# EAGLE schematic Powersupply_RevA_discrete (EAGLE 9.4.2)

## Sheet 1 of 2
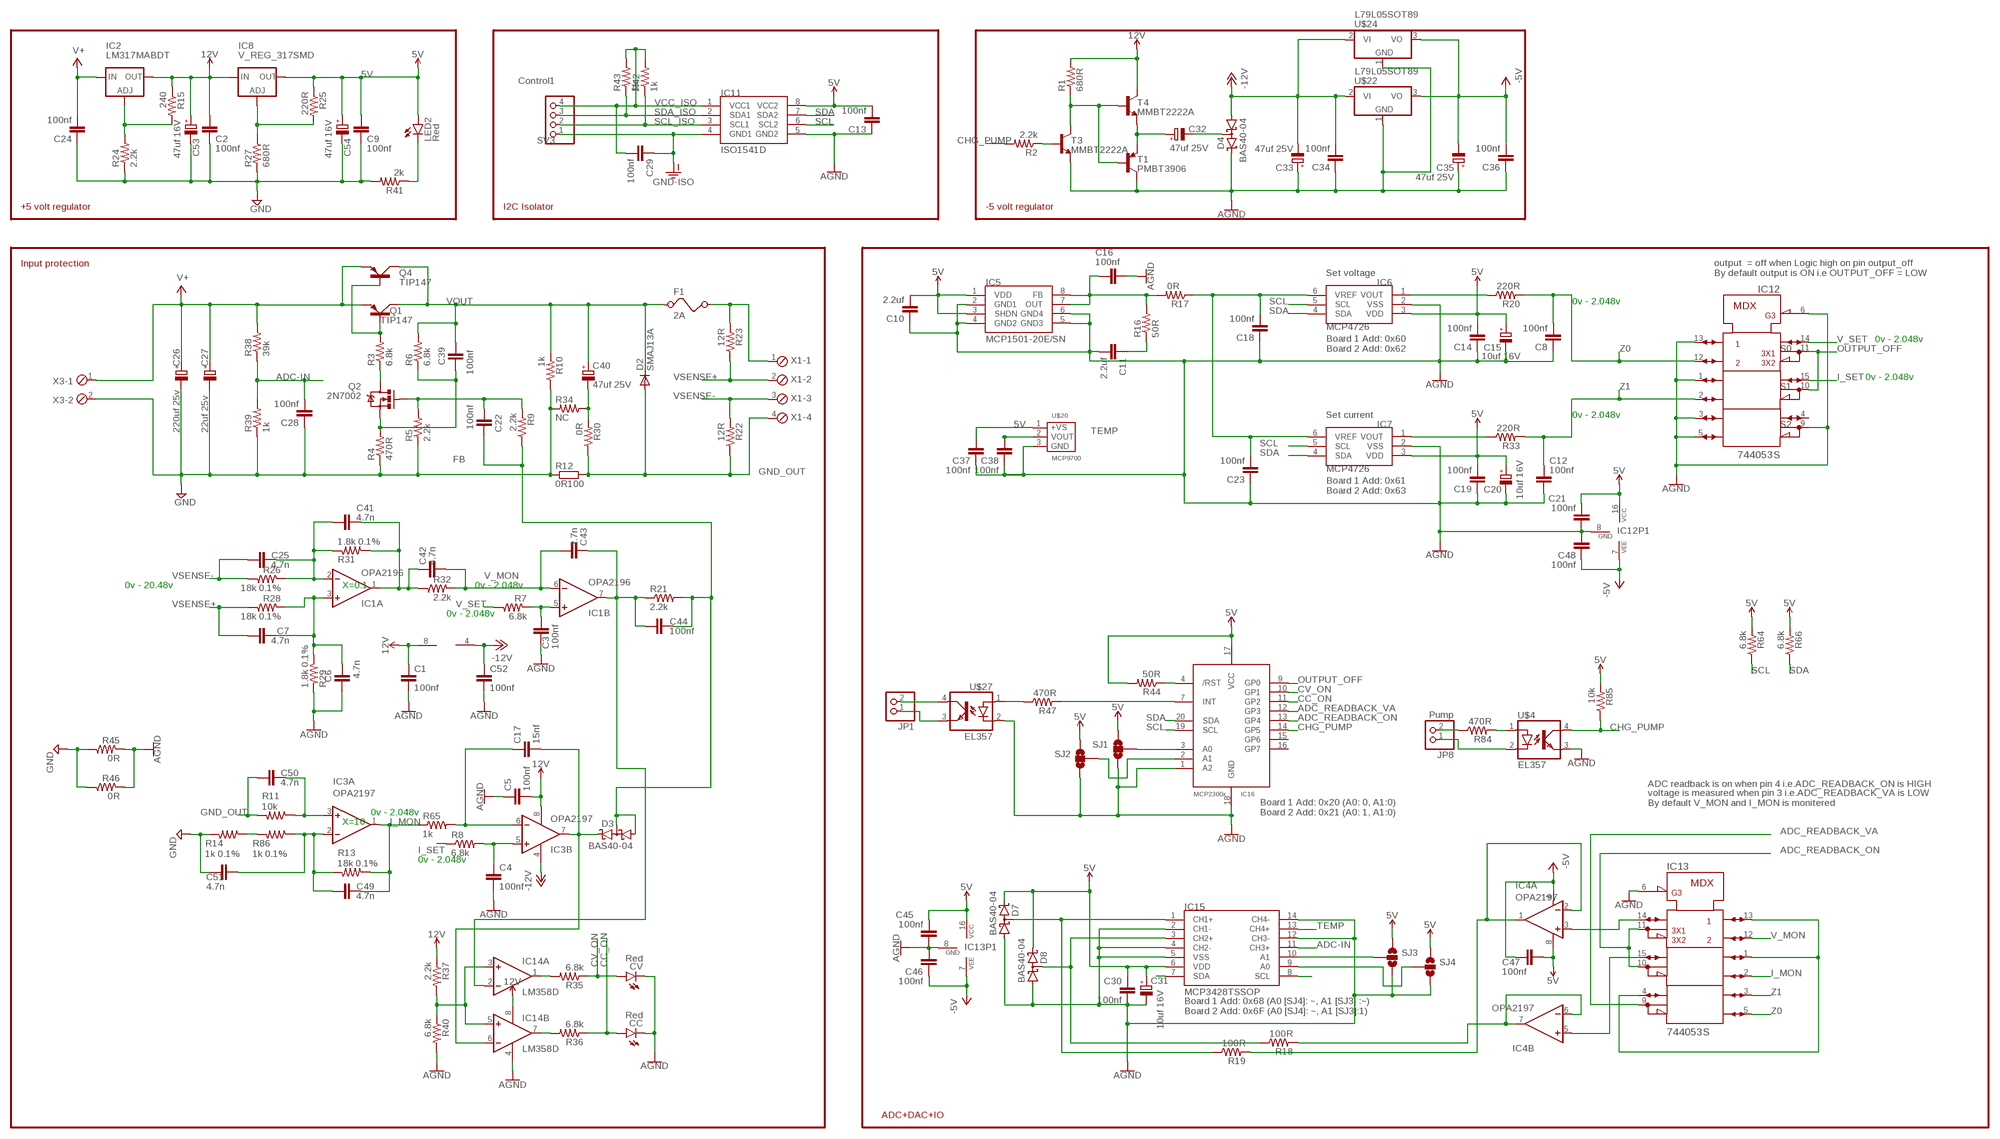
[diagram p0: schematic, sheet 1]

### Parts
C1  100nf  C-EUC0603  [C0603]
C2  100nf  C-EUC0603  [C0603]
C3  100nf  C-EUC0603  [C0603]
C4  100nf  C-EUC0805  [C0805]
C5  100nf  C-EUC0603  [C0603]
C6  4.7n  C-EUC0805  [C0805]
C7  4.7n  C-EUC0805  [C0805]
C8  100nf  C-EUC0603  [C0603]
C9  100nf  C-EUC0603  [C0603]
C10  2.2uf  C-EUC0805  [C0805]
C11  2.2uf  C-EUC0805  [C0805]
C12  100nf  C-EUC0603  [C0603]
C13  100nf  C-EUC0603  [C0603]
C14  100nf  C-EUC0603  [C0603]
C15  10uf 16V  CPOL-EUE2-5  [E2-5]
C16  100nf  C-EUC0603  [C0603]
C17  15nf  C-EUC0805  [C0805]
C18  100nf  C-EUC0603  [C0603]
C19  100nf  C-EUC0603  [C0603]
C20  10uf 16V  CPOL-EUE2-5  [E2-5]
C21  100nf  C-EUC0603  [C0603]
C22  100nf  C-EUC0805  [C0805]
C23  100nf  C-EUC0603  [C0603]
C24  100nf  C-EUC0603  [C0603]
C25  4.7n  C-EUC0805  [C0805]
C26  220uf 25v  CPOL-EUE3.5-8  [E3,5-8]
C27  22uf 25v  CPOL-EUE3.5-8  [E3,5-8]
C28  100nf  C-EUC0603  [C0603]
C29  100nf  C-EUC0603  [C0603]
C30  100nf  C-EUC0603  [C0603]
C31  10uf 16V  CPOL-EUE2-5  [E2-5]
C32  47uf 25V  CPOL-EUCT6032  [CT6032]
C33  47uf 25V  CPOL-EUE2-5  [E2-5]
C34  100nf  C-EUC0603  [C0603]
C35  47uf 25V  CPOL-EUE2-5  [E2-5]
C36  100nf  C-EUC0603  [C0603]
C37  100nf  C-EUC0603  [C0603]
C38  100nf  C-EUC0603  [C0603]
C39  100nf  C-EUC0603  [C0603]
C40  47uf 25V  CPOL-EUE2-5  [E2-5]
C41  4.7n  C-EUC0805  [C0805]
C42  4.7n  C-EUC0805  [C0805]
C43  2.7n  C-EUC0805  [C0805]
C44  100nf  C-EUC0603  [C0603]
C45  100nf  C-EUC0603  [C0603]
C46  100nf  C-EUC0603  [C0603]
C47  100nf  C-EUC0603  [C0603]
C48  100nf  C-EUC0603  [C0603]
C49  4.7n  C-EUC0805  [C0805]
C50  4.7n  C-EUC0805  [C0805]
C51  4.7n  C-EUC0805  [C0805]
C52  100nf  C-EUC0603  [C0603]
C53  47uf 16V  CPOL-EUE2-5  [E2-5]
C54  47uf 16V  CPOL-EUE2-5  [E2-5]
CC  Red  LEDCHIP-LED0805  [CHIP-LED0805]
CV  Red  LEDCHIP-LED0805  [CHIP-LED0805]
D2  SMAJ13A  SMAJ13ASMA403A  [DO214AC]
D3  BAS40-04  [SOT23]
D4  BAS40-04  [SOT23]
D7  BAS40-04  [SOT23]
D8  BAS40-04  [SOT23]
F1  2A  FUSE  [FUSE]
IC1  OPA2196  LM358D  [SO08]
IC2  LM317MABDT  [DPACK]
IC3  OPA2197  LM358D  [SO08]
IC4  OPA2197  OPA2237U  [SO08]
IC5  MCP1501-20E/SN  [SO-08]
IC6  MCP4726  [SOT23-6]
IC7  MCP4726  [SOT23-6]
IC8  V_REG_317SMD  [SOT223]
IC11  ISO1541D  [SO-08]
IC12  744053S  [SO16]
IC13  744053S  [SO16]
IC14  LM358D  [SO08]
IC15  MCP3428TSSOP  [TSSOP14]
IC16  MCP23008QFN20  [QFN20]
JP1  PINHD-1X2  [1X02]
JP8  Pump  PINHD-1X2  [1X02]
LED2  Red  LEDCHIP-LED0805  [CHIP-LED0805]
Q1  TIP147  TIP2955  [TOP3AV]
Q2  2N7002  MOSFET-NCHANNELBSS138  [SOT23]
Q4  TIP147  TIP42C  [TO220AV]
R1  680R  R-US_R0805  [R0805]
R2  2.2k  R-US_R0805  [R0805]
R3  6.8k  R-US_R0805  [R0805]
R4  470R  R-US_R0805  [R0805]
R5  2.2k  R-US_R0805  [R0805]
R6  6.8k  R-US_R0805  [R0805]
R7  6.8k  R-US_R0805  [R0805]
R8  6.8k  R-US_R0805  [R0805]
R9  2.2k  R-US_R0805  [R0805]
R10  1k  R-US_R0805  [R0805]
R11  10k  R-US_R0805  [R0805]
R12  0R100  R-EU_R2512  [R2512]
R13  18k 0.1%  R-US_R0805  [R0805]
R14  1k 0.1%  R-US_R0805  [R0805]
R15  240  R-US_R0805  [R0805]
R16  50R  R-US_R0805  [R0805]
R17  0R  R-US_R0805  [R0805]
R18  100R  R-US_R0805  [R0805]
R19  100R  R-US_R0805  [R0805]
R20  220R  R-US_R0805  [R0805]
R21  2.2k  R-US_R0805  [R0805]
R22  12R  R-US_R0805  [R0805]
R23  12R  R-US_R0805  [R0805]
R24  2.2k  R-US_R0805  [R0805]
R25  220R  R-US_R0805  [R0805]
R26  18k 0.1%  R-US_R0805  [R0805]
R27  680R  R-US_R0805  [R0805]
R28  18k 0.1%  R-US_R0805  [R0805]
R29  1.8k 0.1%  R-US_R0603  [R0603]
R30  0R  R-US_R0805  [R0805]
R31  1.8k 0.1%  R-US_R0603  [R0603]
R32  2.2k  R-US_R0805  [R0805]
R33  220R  R-US_R0805  [R0805]
R34  NC  R-US_R0805  [R0805]
R35  6.8k  R-US_R0805  [R0805]
R36  6.8k  R-US_R0805  [R0805]
R37  2.2k  R-US_R0805  [R0805]
R38  39k  R-US_R0805  [R0805]
R39  1k  R-US_R0805  [R0805]
R40  6.8k  R-US_R0805  [R0805]
R41  2k  R-US_R0805  [R0805]
R42  1k  R-US_R0805  [R0805]
R43  1k  R-US_R0805  [R0805]
R44  50R  R-US_R0805  [R0805]
R45  0R  R-US_R0805  [R0805]
R46  0R  R-US_R0805  [R0805]
R47  470R  R-US_R0805  [R0805]
R64  6.8k  R-US_R0805  [R0805]
R65  1k  R-US_R0805  [R0805]
R66  6.8k  R-US_R0805  [R0805]
R84  470R  R-US_R0805  [R0805]
R85  10k  R-US_R0805  [R0805]
R86  1k 0.1%  R-US_R0805  [R0805]
SJ1  SOLDERJUMPER_2WAY-OLDS  [SJ_3]
SJ2  SOLDERJUMPER_2WAY-OLDS  [SJ_3]
SJ3  SOLDERJUMPER_2WAY-OLDS  [SJ_3]
SJ4  SOLDERJUMPER_2WAY-OLDS  [SJ_3]
SV3  Control1  PINHD-1X4  [1X04]
T1  PMBT3906  MMBT3906LT1-PNP-SOT23-BEC  [SOT23-BEC]
T3  MMBT2222A  MMBT2222ALT1-NPN-SOT23-BEC  [SOT23-BEC]
T4  MMBT2222A  MMBT2222ALT1-NPN-SOT23-BEC  [SOT23-BEC]
U$4  EL357  [EL357]
U$20  MCP9700  [TO92-BCE]
U$22  L79L05SOT89  [SOT89]
U$24  L79L05SOT89  [SOT89]
U$27  EL357  [EL357]
X1  MPT4  [4POL254]
X3  MPT2  [2POL254]

### Nets
5V: C9.2 C10.2 C13.2 C14.2 C15.+ C19.2 C20.+ C21.2 C30.2 C31.+ C37.2 C45.2 C47.1 C54.+ D7.2(C2) D8.2(C2) IC4.8(A:V+) IC5.1(VDD) IC5.3(SHDN) IC6.3(VDD) IC7.3(VDD) IC8.2(OUT) IC11.8(VCC2) IC12.16(VCC) IC13.16(VCC) IC15.6(VDD) IC16.17(VCC) LED2.A R25.1 R44.2 R64.2 R66.2 R85.2 SJ1.1 SJ2.1 SJ3.1 SJ4.1 U$20.1(+VS)
12V: C1.1 C2.2 C5.2 C53.+ IC1.8(P:V+) IC2.4(OUT) IC3.8(P:V+) IC8.3(IN) IC14.8(P:V+) R1.2 R15.1 R37.1 T4.C
-5V: C35.- C36.2 C46.1 C47.2 C48.1 IC4.4(A:V-) IC12.7(VEE) IC13.7(VEE) U$22.3(VO) U$24.3(VO)
-12V: C33.- C34.2 C52.1 D4.1(A1) IC1.4(P:V-) IC3.4(P:V-) U$22.2(VI) U$24.2(VI)
ADC-IN: C28.2 IC15.11(CH3+) R38.1 R39.2
ADC-IOUT: IC4.6(B:-IN) IC4.7(B:OUT) R18.2
ADC-VOUT: IC4.1(A:OUT) IC4.2(A:-IN) R19.2
ADC_READBACK_ON: IC13.10 IC13.11 IC16.13(GP4)
ADC_READBACK_VA: IC13.9 IC16.12(GP3)
AGND: C1.2 C3.2 C4.2 C5.1 C6.2 C8.1 C10.1 C11.2 C12.1 C13.1 C14.1 C15.- C16.2 C18.1 C19.1 C20.- C21.1 C23.1 C30.1 C31.- C33.+ C34.1 C35.+ C36.1 C37.1 C38.1 C45.1 C46.2 C48.2 C52.2 CC.C CV.C D4.2(C2) D7.1(A1) D8.1(A1) IC5.2(GND1) IC5.4(GND2) IC5.5(GND3) IC5.6(GND4) IC6.2(VSS) IC7.2(VSS) IC11.5(GND2) IC12.1 IC12.3 IC12.5 IC12.6(!G) IC12.8(GND) IC12.9 IC12.13 IC13.6(!G) IC13.8(GND) IC14.4(P:V-) IC15.2(CH1-) IC15.4(CH2-) IC15.5(VSS) IC15.12(CH3-) IC15.14(CH4-) IC16.1(A2) IC16.18(GND) R29.2 R40.2 R45.2 R46.2 SJ1.3 SJ2.3 SJ3.3 SJ4.3 T1.C T3.E U$4.3(EMIT) U$20.3(GND) U$22.1(GND) U$24.1(GND) U$27.2(C)
CC_ON: CC.A IC16.11(GP2) R36.1
CHG_PUMP: IC16.14(GP5) R2.2 R85.1 U$4.4(COL)
CV_ON: CV.A IC16.10(GP1) R35.1
FB: C22.2 C44.1 D3.1(A1) D3.3(C1A2) R9.1 R21.2
GND: C2.1 C9.1 C24.1 C26.- C27.- C28.1 C51.1 C53.- C54.- R4.1 R5.1 R10.1 R12.1 R14.2 R24.1 R27.2 R34.2 R39.1 R41.2 R45.1 R46.1 X3.2 ; also sheet 2
GND-ISO: C29.1 IC11.4(GND1) SV3.1
GND_OUT: C50.2 D2.A R11.2 R12.2 R22.1 R30.1 X1.4
I_MON: C49.1 IC3.1(A:OUT) IC13.2 R13.1 R65.1
I_SET: IC12.15 R8.1
N$1: C17.1 IC3.6(B:-IN) R65.2
N$2: IC2.1(ADJ) R15.2 R24.2
N$3: C50.1 IC3.3(A:+IN) R11.1
N$4: C49.2 C51.2 IC3.2(A:-IN) R13.2 R86.1
N$5: F1.2 R23.2 X1.1
N$6: R47.1 U$27.1(A)
N$7: C25.1 C41.2 IC1.2(A:-IN) R26.2 R31.2
N$8: C16.1 IC5.7(OUT) IC5.8(FB) R16.2 R17.2
N$9: IC14.3(A:+IN) IC14.5(B:+IN) R37.2 R40.1
N$10: C43.2 C44.2 IC1.7(B:OUT) IC14.2(A:-IN) R21.1
N$11: C6.1 C7.1 IC1.3(A:+IN) R28.2 R29.1
N$12: C17.2 D3.2(C2) IC3.7(B:OUT) IC14.6(B:-IN)
N$13: IC8.1(ADJ) R25.2 R27.1
N$14: IC7.1(VOUT) R33.1
N$15: C11.1 R16.1
N$16: C3.1 IC1.5(B:+IN) R7.2
N$17: C4.1 IC3.5(B:+IN) R8.2
N$18: D8.3(C1A2) IC15.3(CH2+) R18.1
N$19: C40.- R30.2 R34.1
N$20: IC16.4(/RST) R44.1
N$21: IC16.3(A0) SJ1.2
N$22: IC4.3(A:+IN) IC13.14
N$23: Q1.B Q4.B R3.2
N$24: LED2.C R41.1
N$25: IC4.5(B:+IN) IC13.15
N$26: D7.3(C1A2) IC15.1(CH1+) R19.1
N$27: IC14.1(A:OUT) R35.2
N$28: IC16.2(A1) SJ2.2
N$29: IC15.10(A1) SJ3.2
N$30: IC15.9(A0) SJ4.2
N$31: R2.1 T3.B
N$32: Q2.3(D) R3.1
N$33: R1.1 T1.B T3.C T4.B
N$34: IC13.1 IC13.4 IC13.13
N$35: C32.+ T1.E T4.E
N$36: C32.- D4.3(C1A2)
N$37: IC6.1(VOUT) R20.1
N$38: C22.1 Q2.1(G) R5.2 R9.2
N$39: IC14.7(B:OUT) R36.2
N$40: C39.1 Q2.2(S) R4.2 R6.1
N$41: JP1.2 U$27.4(COL)
N$42: C41.1 C42.2 IC1.1(A:OUT) R31.1 R32.1
N$43: JP1.1 U$27.3(EMIT)
N$44: IC16.7(INT) R47.2
N$61: JP8.2 R84.1
N$75: R84.2 U$4.1(A)
N$76: JP8.1 U$4.2(C)
N$77: R14.1 R86.2
OUTPUT_OFF: IC12.10 IC12.11 IC16.9(GP0)
SCL: IC6.5(SCL) IC7.5(SCL) IC11.6(SCL2) IC15.8(SCL) IC16.19(SCL) R64.1
SCL_ISO: IC11.3(SCL1) R42.1 SV3.2
SDA: IC6.4(SDA) IC7.4(SDA) IC11.7(SDA2) IC15.7(SDA) IC16.20(SDA) R66.1
SDA_ISO: IC11.2(SDA1) R43.1 SV3.3
TEMP: C38.2 IC15.13(CH4+) U$20.2(VOUT)
V+: C24.2 C26.+ C27.+ IC2.3(IN) Q1.E Q4.E R38.2 X3.1
V_MON: C42.1 C43.1 IC1.6(B:-IN) IC13.12 R32.2
V_SET: IC12.14 R7.1
VCC_ISO: C29.2 IC11.1(VCC1) R42.2 R43.2 SV3.4
VOUT: C39.2 C40.+ D2.C F1.1 Q1.C Q4.C R6.2 R10.2
VREF: C18.2 C23.2 IC6.6(VREF) IC7.6(VREF) R17.1
VSENSE+: C7.2 R23.1 R28.1 X1.2
VSENSE-: C25.2 R22.2 R26.1 X1.3
Z0: C8.2 IC12.12 IC13.5 R20.2
Z1: C12.2 IC12.2 IC13.3 R33.2
Unconnected: IC12.4 IC16.15(GP6) IC16.16(GP7)

### Notes on the sheet
- +5 volt regulator | I2C Isolator | -5 volt regulator
- Input protection
- Set voltage
- output  = off when Logic high on pin output_off
  By default output is ON i.e OUTPUT_OFF = LOW
- 0v - 2.048v
- 0v - 2.048v
- Board 1 Add: 0x60
  Board 2 Add: 0x62
- S0
- 0v - 2.048v
- S1
- Set current | 0v - 2.048v
- S2
- Board 1 Add: 0x61
  Board 2 Add: 0x63
- 0v - 20.48v | X=0.1 | 0v - 2.048v
- 0v - 2.048v
- ADC readback is on when pin 4 i.e.ADC_READBACK_ON is HIGH
- voltage is measured when pin 3 i.e.ADC_READBACK_VA is LOW
  By default V_MON and I_MON is monitered
- 0v - 2.048v
- Board 1 Add: 0x20 (A0: 0, A1:0)
  Board 2 Add: 0x21 (A0: 1, A1:0)
- X=10
- 0v - 2.048v
- Board 1 Add: 0x68 (A0 [SJ4]: ~, A1 [SJ3] :~)
  Board 2 Add: 0x6F (A0 [SJ4]: ~, A1 [SJ3]:1)
- ADC+DAC+IO

## Sheet 2 of 2
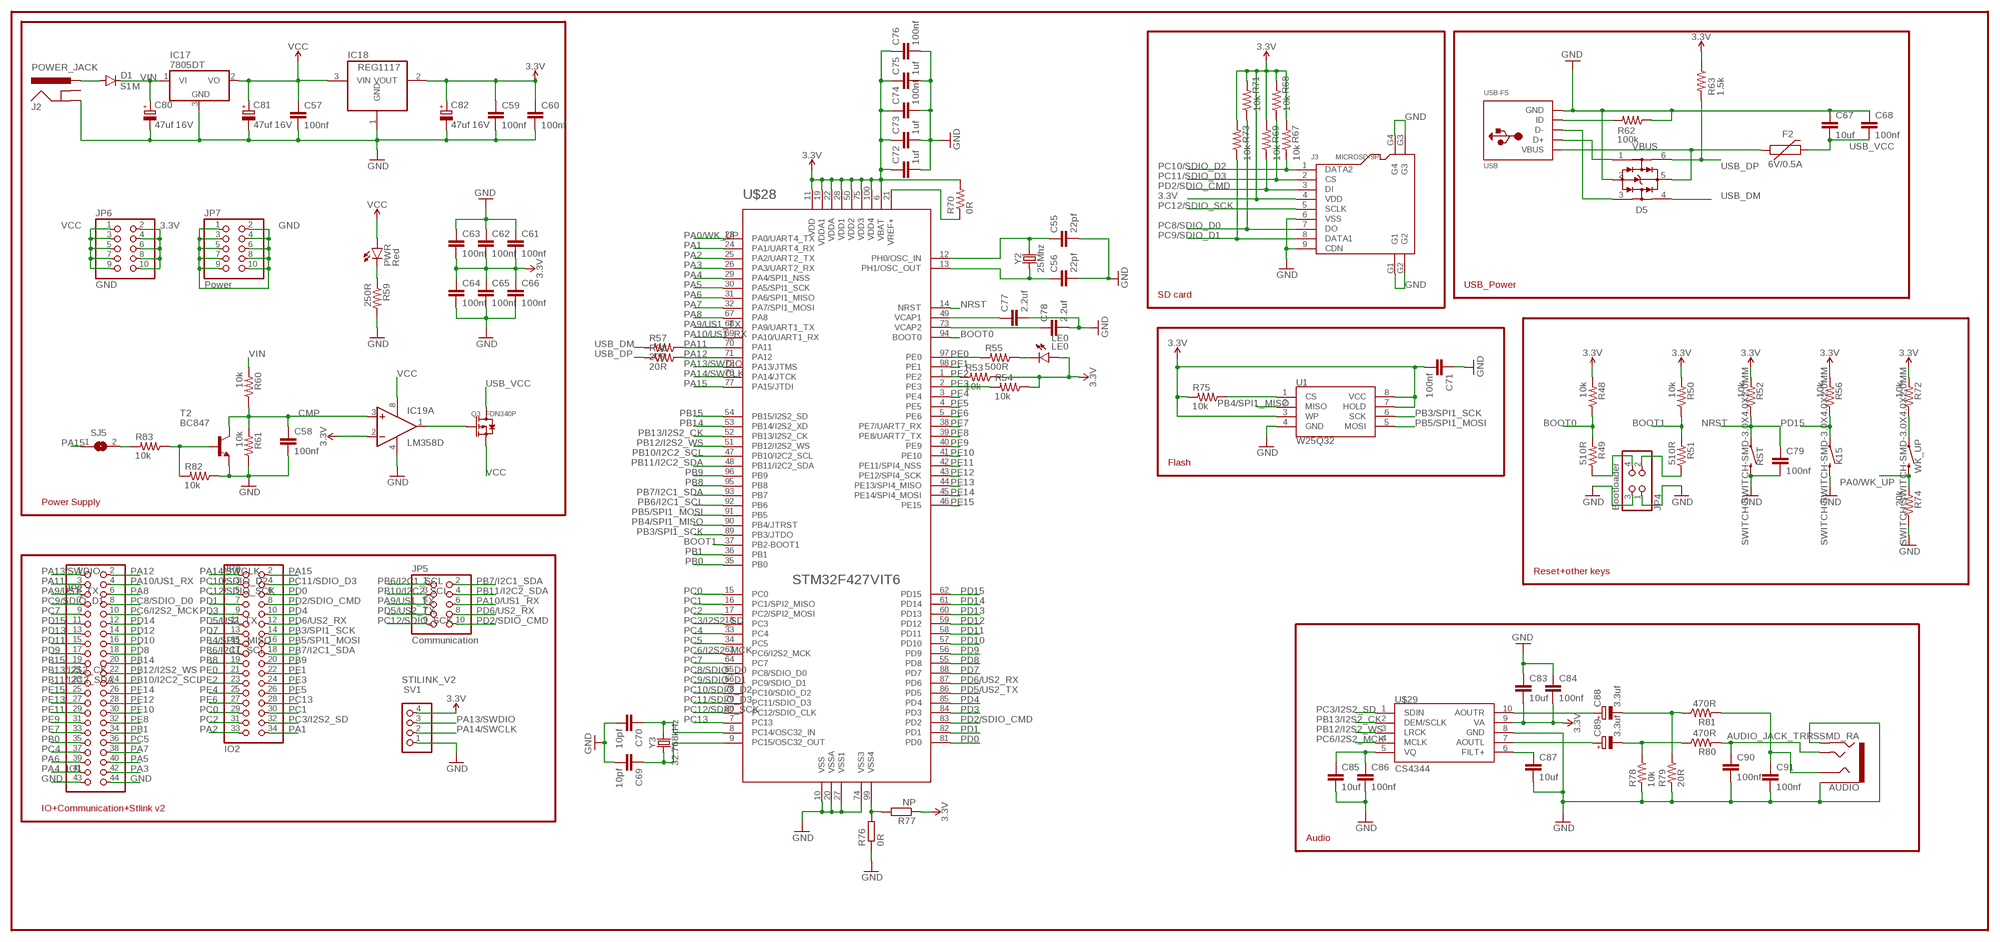
[diagram p1: schematic, sheet 2]

### Parts
AUDIO  AUDIO_JACK_TRRSSMD_RA  [AUDIO_JACK_3.5MM_TRRS_SMD_RA]
C55  22pf  C-EUC0805  [C0805]
C56  22pf  C-EUC0805  [C0805]
C57  100nf  C-EUC0603  [C0603]
C58  100nf  C-EUC0603  [C0603]
C59  100nf  C-EUC0603  [C0603]
C60  100nf  C-EUC0603  [C0603]
C61  100nf  C-EUC0603  [C0603]
C62  100nf  C-EUC0603  [C0603]
C63  100nf  C-EUC0603  [C0603]
C64  100nf  C-EUC0603  [C0603]
C65  100nf  C-EUC0603  [C0603]
C66  100nf  C-EUC0603  [C0603]
C67  10uf  C-EUC0805  [C0805]
C68  100nf  C-EUC0603  [C0603]
C69  10pf  C-EUC0805  [C0805]
C70  10pf  C-EUC0805  [C0805]
C71  100nf  C-EUC0603  [C0603]
C72  1uf  C-EUC0805  [C0805]
C73  1uf  C-EUC0805  [C0805]
C74  100nf  C-EUC0603  [C0603]
C75  1uf  C-EUC0805  [C0805]
C76  100nf  C-EUC0603  [C0603]
C77  2.2uf  C-EUC0805  [C0805]
C78  2.2uf  C-EUC0805  [C0805]
C79  100nf  C-EUC0603  [C0603]
C80  47uf 16V  CPOL-EUE2-5  [E2-5]
C81  47uf 16V  CPOL-EUE2-5  [E2-5]
C82  47uf 16V  CPOL-EUE2-5  [E2-5]
C83  10uf  C-EUC1210  [C1210]
C84  100nf  C-EUC0603  [C0603]
C85  10uf  C-EUC1210  [C1210]
C86  100nf  C-EUC0603  [C0603]
C87  10uf  C-EUC1210  [C1210]
C88  3.3uf  CPOL-EUA/3216-18R  [A/3216-18R]
C89  3.3uf  CPOL-EUA/3216-18R  [A/3216-18R]
C90  100nf  C-EUC0603  [C0603]
C91  100nf  C-EUC0603  [C0603]
D1  S1M  [SMA]
D5  USBLC6-2P  [SOT23-6]
F2  6V/0.5A  PPTC_HALF-AMP  [1206]
IC17  7805DT  [TO252]
IC18  REG1117  [SOT223]
IC19  LM358D  [SO08]
J2  POWER_JACK  [POWER_JACK_PTH]
J3  MICROSD-9P  MICRO-SD-CARD-HOLDER-9P  [MICRO-SD9+4P-SMD-16.1X14.5X1.85MM]
JP2  IO1  PINHD-2X22  [2X22]
JP3  IO2  PINHD-2X17  [2X17]
JP4  Bootloader  PINHD-2X2  [2X02]
JP5  Communication  PINHD-2X5  [2X05]
JP6  GND  PINHD-2X5  [2X05]
JP7  Power  PINHD-2X5  [2X05]
K15  SWITCH-SWITCH-SMD-3.0X4.0X2.0MM  [TACTILE_SWITCH_SMD_6.0X3.5MM]
LE0  LE0  LEDCHIP-LED0805  [CHIP-LED0805]
PWR  Red  LEDCHIP-LED0805  [CHIP-LED0805]
Q3  FDN340P  SMD-MOSFET-P-CH-20V-2A-FDN340P(SOT-23)  [SOT-23]
R48  10k  R-US_R0805  [R0805]
R49  510R  R-US_R0805  [R0805]
R50  10k  R-US_R0805  [R0805]
R51  510R  R-US_R0805  [R0805]
R52  10k  R-US_R0805  [R0805]
R53  10k  R-US_R0805  [R0805]
R54  10k  R-US_R0805  [R0805]
R55  500R  R-US_R0805  [R0805]
R56  10k  R-US_R0805  [R0805]
R57  20R  R-US_R0805  [R0805]
R58  20R  R-US_R0805  [R0805]
R59  250R  R-US_R0805  [R0805]
R60  10k  R-US_R0805  [R0805]
R61  10k  R-US_R0805  [R0805]
R62  100k  R-US_R0805  [R0805]
R63  1.5k  R-US_R0805  [R0805]
R67  10k  R-US_R0805  [R0805]
R68  10k  R-US_R0805  [R0805]
R69  10k  R-US_R0805  [R0805]
R70  0R  R-US_R0805  [R0805]
R71  10k  R-US_R0805  [R0805]
R72  10k  R-US_R0805  [R0805]
R73  10k  R-US_R0805  [R0805]
R74  20k  R-US_R0805  [R0805]
R75  10k  R-US_R0805  [R0805]
R76  0R  R-EU_R0402  [R0402]
R77  NP  R-EU_R0402  [R0402]
R78  10k  R-US_R0805  [R0805]
R79  20R  R-US_R0805  [R0805]
R80  470R  R-US_R0805  [R0805]
R81  470R  R-US_R0805  [R0805]
R82  10k  R-US_R0805  [R0805]
R83  10k  R-US_R0805  [R0805]
RST  SWITCH-SWITCH-SMD-3.0X4.0X2.0MM  [TACTILE_SWITCH_SMD_6.0X3.5MM]
SJ5  SJ  [SJ]
SV1  STlLINK_V2  PINHD-1X4  [1X04]
T2  BC847  [SOT23]
U1  W25Q32  SPI_FLASH-X25XXSMD  [SO08]
U$28  STM32F427VIT6  [LQFP100]
U$29  CS4344  [TSSOP10]
USB  USB-FS  USBMINIB  [USB-MINIB]
WK_UP  SWITCH-SWITCH-SMD-3.0X4.0X2.0MM  [TACTILE_SWITCH_SMD_6.0X3.5MM]
Y2  25Mhz  CRYSTALSMD-3.2X2.5  [CRYSTAL-SMD-3.2X2.5MM]
Y3  32.768kHz  CRYSTAL-32.768KHZPTH-2X6  [CRYSTAL-PTH-2X6-CYL]

### Nets
3.3V: C59.1 C60.1 C61.2 C62.2 C63.2 C64.1 C65.1 C66.1 C71.2 C72.1 C73.1 C74.1 C75.1 C76.1 C82.+ C83.2 C84.2 IC18.2(VOUT) IC19.2(A:-IN) J3.4(VDD) JP6.2 JP6.4 JP6.6 JP6.8 JP6.10 LE0.A R48.2 R50.2 R52.2 R53.1 R54.1 R56.2 R63.1 R67.2 R68.2 R69.2 R70.2 R71.2 R72.2 R73.2 R75.2 R77.1 SV1.4 U1.3(WP) U1.7(HOLD) U1.8(VCC) U$28.6(VBAT) U$28.11(VDD) U$28.19(VDDA1) U$28.22(VDDA) U$28.28(VDD1) U$28.50(VDD2) U$28.75(VDD3) U$28.100(VDD4) U$29.9(VA)
BOOT0: R48.1 R49.2 U$28.94(BOOT0)
BOOT1: R50.1 R51.2 U$28.37(PB2-BOOT1)
CMP: C58.1 IC19.3(A:+IN) R60.1 R61.2 T2.3(C)
GND: AUDIO.EARTH AUDIO.RING2 C55.2 C56.2 C57.2 C58.2 C59.2 C60.2 C61.1 C62.1 C63.1 C64.2 C65.2 C66.2 C67.1 C68.1 C69.2 C70.2 C71.1 C72.2 C73.2 C74.2 C75.2 C76.2 C77.2 C78.2 C79.2 C80.- C81.- C82.- C83.1 C84.1 C85.2 C86.2 C87.2 C90.2 C91.2 D5.2(GND) IC17.3(GND) IC18.1(GND) IC19.4(P:V-) J2.GND J3.6(VSS) J3.9(CDN) J3.G1 J3.G2 J3.G3 J3.G4 JP2.43 JP2.44 JP4.1 JP4.3 JP7.1 JP7.2 JP7.3 JP7.4 JP7.5 JP7.6 JP7.7 JP7.8 JP7.9 JP7.10 K15.2 R59.2 R61.1 R62.1 R74.1 R76.1 R78.2 R79.2 R82.1 RST.2 SV1.1 T2.2(E) U1.4(GND) U$28.10(VSS) U$28.20(VSSA) U$28.27(VSS1) U$28.74(VSS3) U$29.8(GND) USB.GND ; also sheet 1
N$45: C55.1 U$28.12(PH0/OSC_IN) Y2.3
N$46: C56.1 U$28.13(PH1/OSC_OUT) Y2.1
N$47: IC19.1(A:OUT) Q3.1(G)
N$48: C69.1 U$28.9(PC15/OSC32_OUT) Y3.1
N$49: C70.1 U$28.8(PC14/OSC32_IN) Y3.2
N$50: R62.2 USB.ID
N$51: LE0.C R55.1
N$52: D1.A J2.PWR
N$53: C77.1 U$28.49(VCAP1)
N$54: C78.1 U$28.73(VCAP2)
N$55: PWR.C R59.1
N$56: D5.1(I/O1-IN) USB.D+
N$57: JP4.4 R49.1
N$58: JP4.2 R51.1
N$59: R82.2 R83.1 T2.1(B)
N$60: R83.2 SJ5.2
N$62: R70.1 U$28.21(VREF+)
N$63: R72.1 WK_UP.1
N$64: R75.1 U1.1(CS)
N$65: D5.3(I/O2-IN) USB.D-
N$66: R76.2 R77.2 U$28.99(VSS4)
N$67: C87.1 U$29.6(FILT+)
N$68: C85.1 C86.1 U$29.5(VQ)
N$69: C88.+ U$29.10(AOUTR)
N$70: C89.+ U$29.7(AOUTL)
N$71: C89.- R78.1 R80.1
N$72: C88.- R79.1 R81.1
N$73: AUDIO.TIP C90.1 R80.2
N$74: AUDIO.RING1 C91.1 R81.2
NRST: C79.1 R52.1 RST.1 U$28.14(NRST)
PA0/WK_UP: R74.2 U$28.23(PA0/UART4_TX) WK_UP.2
PA1: JP3.34 U$28.24(PA1/UART4_RX)
PA2: JP3.33 U$28.25(PA2/UART2_TX)
PA3: JP2.42 U$28.26(PA3/UART2_RX)
PA4: JP2.41 U$28.29(PA4/SPI1_NSS)
PA5: JP2.40 U$28.30(PA5/SPI1_SCK)
PA6: JP2.39 U$28.31(PA6/SPI1_MISO)
PA7: JP2.38 U$28.32(PA7/SPI1_MOSI)
PA8: JP2.6 U$28.67(PA8)
PA9/US1_TX: JP2.5 JP5.5 U$28.68(PA9/UART1_TX)
PA10/US1_RX: JP2.4 JP5.6 U$28.69(PA10/UART1_RX)
PA11: JP2.3 R57.1 U$28.70(PA11)
PA12: JP2.2 R58.1 U$28.71(PA12)
PA13/SWDIO: JP2.1 SV1.3 U$28.72(PA13/JTMS)
PA14/SWCLK: JP3.1 SV1.2 U$28.76(PA14/JTCK)
PA15: JP3.2 SJ5.1 U$28.77(PA15/JTDI)
PB0: JP2.35 U$28.35(PB0)
PB1: JP2.34 U$28.36(PB1)
PB3/SPI1_SCK: JP3.14 U1.6(SCK) U$28.89(PB3/JTDO)
PB4/SPI1_MISO: JP3.15 U1.2(MISO) U$28.90(PB4/JTRST)
PB5/SPI1_MOSI: JP3.16 U1.5(MOSI) U$28.91(PB5)
PB6/I2C1_SCL: JP3.17 JP5.1 U$28.92(PB6)
PB7/I2C1_SDA: JP3.18 JP5.2 U$28.93(PB7)
PB8: JP3.19 U$28.95(PB8)
PB9: JP3.20 U$28.96(PB9)
PB10/I2C2_SCL: JP2.24 JP5.3 U$28.47(PB10/I2C2_SCL)
PB11/I2C2_SDA: JP2.23 JP5.4 U$28.48(PB11/I2C2_SDA)
PB12/I2S2_WS: JP2.22 U$28.51(PB12/I2S2_WS) U$29.3(LRCK)
PB13/I2S2_CK: JP2.21 U$28.52(PB13/I2S2_CK) U$29.2(DEM/SCLK)
PB14: JP2.20 U$28.53(PB14/I2S2_XD)
PB15: JP2.19 U$28.54(PB15/I2S2_SD)
PC0: JP3.29 U$28.15(PC0)
PC1: JP3.30 U$28.16(PC1/SPI2_MISO)
PC2: JP3.31 U$28.17(PC2/SPI2_MOSI)
PC3/I2S2_SD: JP3.32 U$28.18(PC3) U$29.1(SDIN)
PC4: JP2.37 U$28.33(PC4)
PC5: JP2.36 U$28.34(PC5)
PC6/I2S2_MCK: JP2.10 U$28.63(PC6/I2S2_MCK) U$29.4(MCLK)
PC7: JP2.9 U$28.64(PC7)
PC8/SDIO_D0: J3.7(DO) JP2.8 R71.1 U$28.65(PC8/SDIO_D0)
PC9/SDIO_D1: J3.8(DATA1) JP2.7 R73.1 U$28.66(PC9/SDIO_D1)
PC10/SDIO_D2: J3.1(DATA2) JP3.3 R67.1 U$28.78(PC10/SDIO_D2)
PC11/SDIO_D3: J3.2(CS) JP3.4 R68.1 U$28.79(PC11/SDIO_D3)
PC12/SDIO_SCK: J3.5(SCLK) JP3.5 JP5.9 U$28.80(PC12/SDIO_CLK)
PC13: JP3.28 U$28.7(PC13)
PD0: JP3.6 U$28.81(PD0)
PD1: JP3.7 U$28.82(PD1)
PD2/SDIO_CMD: J3.3(DI) JP3.8 JP5.10 R69.1 U$28.83(PD2)
PD3: JP3.9 U$28.84(PD3)
PD4: JP3.10 U$28.85(PD4)
PD5/US2_TX: JP3.11 JP5.7 U$28.86(PD5)
PD6/US2_RX: JP3.12 JP5.8 U$28.87(PD6)
PD7: JP3.13 U$28.88(PD7)
PD8: JP2.18 U$28.55(PD8)
PD9: JP2.17 U$28.56(PD9)
PD10: JP2.16 U$28.57(PD10)
PD11: JP2.15 U$28.58(PD11)
PD12: JP2.14 U$28.59(PD12)
PD13: JP2.13 U$28.60(PD13)
PD14: JP2.12 U$28.61(PD14)
PD15: JP2.11 K15.1 R56.1 U$28.62(PD15)
PE0: JP3.21 R55.2 U$28.97(PE0)
PE1: JP3.22 U$28.98(PE1)
PE2: JP3.23 R53.2 U$28.1(PE2)
PE3: JP3.24 R54.2 U$28.2(PE3)
PE4: JP3.25 U$28.3(PE4)
PE5: JP3.26 U$28.4(PE5)
PE6: JP3.27 U$28.5(PE6)
PE7: JP2.33 U$28.38(PE7/UART7_RX)
PE8: JP2.32 U$28.39(PE8/UART7_TX)
PE9: JP2.31 U$28.40(PE9)
PE10: JP2.30 U$28.41(PE10)
PE11: JP2.29 U$28.42(PE11/SPI4_NSS)
PE12: JP2.28 U$28.43(PE12/SPI4_SCK)
PE13: JP2.27 U$28.44(PE13/SPI4_MISO)
PE14: JP2.26 U$28.45(PE14/SPI4_MOSI)
PE15: JP2.25 U$28.46(PE15)
USB_DM: D5.4(I/O2-OUT) R57.2
USB_DP: D5.6(I/O1-OUT) R58.2 R63.2
USB_VCC: C67.2 C68.2 F2.2 Q3.3(D)
VBUS: D5.5(VBUS) F2.1 USB.VBUS
VCC: C57.1 C81.+ IC17.2(VO) IC18.3(VIN) IC19.8(P:V+) JP6.1 JP6.3 JP6.5 JP6.7 JP6.9 PWR.A Q3.2(S)
VIN: C80.+ D1.C IC17.1(VI) R60.2
Unconnected: IC19.5(B:+IN) IC19.6(B:-IN) IC19.7(B:OUT) J2.GNDBREAK

### Notes on the sheet
- USB_Power
- SD card
- Flash
- Power Supply
- Reset+other keys
- IO+Communication+Stlink v2
- Audio

## Library data of the parts
AUDIO = SparkFun-Connectors:AUDIO_JACK_TRRS: Audio Jack - 3.5mm TRRS (SMD) This is a 3.5mm TRRS SMD audio jack. TRRS connectors are the audio-style connectors that you see on some phones, MP3 players and development boards. TRRS stands for “tip, ring, ring, sleeve,” which reflects that this has three conductors and a ground. SparkFun Products: Audio Jack <https://www.sparkfun.com/products/12639> mbed Starter Kit <https://www.sparkfun.com/products/12968> SparkFun TRRS 3.5mm Jack Breakout <https://www.sparkfun.com/products/11570>; PROD_ID: CONN-10676; SF_ID: PRT-12639
C1-C14 C16-C19 C21-C25 C28-C30 C34 C36-C39 C41-C52 C55-C79 C83-C87 C90 C91 = rcl:C-EU: CAPACITOR, European symbol; SPICEPREFIX: C
C15 C20 C26 C27 C31-C33 C35 C40 C53 C54 C80-C82 C88 C89 = rcl:CPOL-EU: POLARIZED CAPACITOR, European symbol; SPICEPREFIX: C
CC CV LE0 LED2 PWR = led:LED: LED OSRAM: - CHIPLED LG R971, LG N971, LY N971, LG Q971, LY Q971, LO R971, LY R971 LH N974, LH R974 LS Q976, LO Q976, LY Q976 LO Q996 - Hyper CHIPLED LW Q18S LB Q993, LB Q99A, LB R99A - SideLED LS A670, LO A670, LY A670, LG A670, LP A670 LB A673, LV A673, LT A673, LW A673 LH A674 LY A675 LS A676, LA A676, LO A676, LY A676, LW A676 LS A679, LY A679, LG A679 - Hyper Micro SIDELED® LS Y876, LA Y876, LO Y876, LY Y876 LT Y87S - SmartLED LW L88C, LW L88S LB L89C, LB L89S, LG L890 LS L89K, LO L89K, LY L89K LS L896, LA L896, LO L896, LY L896 - TOPLED LS T670, LO T670, LY T670, LG T670, LP T670 LSG T670, LSP T670, LSY T670, LOP T670, LYG T670 LG T671, LOG T671, LSG T671 LB T673, LV T673, LT T673, LW T673 LH T674 LS T676, LA T676, LO T676, LY T676, LB T676, LH T676, LSB T676, LW T676 LB T67C, LV T67C, LT T67C, LS T67K, LO T67K, LY T67K, LW E67C LS E67B, LA E67B, LO E67B, LY E67B, LB E67C, LV E67C, LT E67C LW T67C LS T679, LY T679, LG T679 LS T770, LO T770, LY T770, LG T770, LP T770 LB T773, LV T773, LT T773, LW T773 LH T774 LS E675, LA E675, LY E675, LS T675 LS T776, LA T776, LO T776, LY T776, LB T776 LHGB T686 LT T68C, LB T68C - Hyper Mini TOPLED® LB M676 - Mini TOPLED Santana® LG M470 LS M47K, LO M47K, LY M47K Source: http://www.osram.convergy.de LUXEON: - LUMILED® LXK2-PW12-R00, LXK2-PW12-S00, LXK2-PW14-U00, LXK2-PW14-V00 LXK2-PM12-R00, LXK2-PM12-S00, LXK2-PM14-U00 LXK2-PE12-Q00, LXK2-PE12-R00, LXK2-PE12-S00, LXK2-PE14-T00, LXK2-PE14-U00 LXK2-PB12-K00, LXK2-PB12-L00, LXK2-PB12-M00, LXK2-PB14-N00, LXK2-PB14-P00, LXK2-PB14-Q00 LXK2-PR12-L00, LXK2-PR12-M00, LXK2-PR14-Q00, LXK2-PR14-R00 LXK2-PD12-Q00, LXK2-PD12-R00, LXK2-PD12-S00 LXK2-PH12-R00, LXK2-PH12-S00 LXK2-PL12-P00, LXK2-PL12-Q00, LXK2-PL12-R00 Source: www.luxeon.com KINGBRIGHT: KA-3528ASYC Source: www.kingbright.com
D1 = diode:S1M
D2 = My library:SMAJ13A: DIODE standard rectifier, 3 A, 40 V (Motorola)
D3 D4 D7 D8 = diode:BAS40-04: Silicon Schottky Diodes General-purpose diode for high-speed switching
D5 = My library:USBLC6-2P
F1 = special:FUSE: FUSE 5 x 20 mm
F2 = SparkFun-Fuses:PPTC: Resettable Fuse PPTC Resettable Fuse. Really a sort of resistor with a polymeric positive temperature coefficient whose resistance increases dramatically with an increase in temperature. When heated by the power passing through the resistance rises causing the current to be limited, protecting the circuit. This is achieved by the transition of the polymer from a crystalline to an amorphous state where the conductive carbon separates breaking the conductive pathways found in the cool crystalline structure. When a PPTC cools back down it resumes conducting letting the circuit turn back on. SparkFun Products: SparkFun RedBoard - Programmed with Arduino <https://www.sparkfun.com/products/12757> Pro Micro - 5V/16MHz <https://www.sparkfun.com/products/12640> Arduino Pro 328 - 5V/16MHz <https://www.sparkfun.com/products/10915> MP3 Trigger <https://www.sparkfun.com/products/13720>; PROD_ID: RES-08585
IC1 IC3 IC14 IC19 = linear:LM358: OP AMP also LM158; LM258; LM2904 Source: http://cache.national.com/ds/LM/LM158.pdf
IC2 = v-reg:LM317?*: 500 mA Adjustable Output Positive Voltage Regulator Source: http://www.onsemi.co.jp .. LM317M-D.PDF
IC4 = burr-brown:OPA2237: Single-Supply Operational Amplifiers MicroAmplifier(TM) Series; Product Folder:OPA2237; MF: TEXAS INSTRUMENTS; MPN: OPA2237UA; OC_FARNELL: 1388075; OC_NEWARK: 80K6018
IC5 = My library:MCP1501-20E/SN; SPICEPREFIX: X
IC6 IC7 = My library:MCP4726
IC8 = SparkFun-IC-Power:V_REG_317: Voltage Regulator Standard LM317 adjustable voltage regulator. AOI (Adjust Output Input). Google 'LM317 Calculator' for easy to use app to get the two resistor values needed. 240/720 for 5V output. 240/390 for 3.3V output. Spark Fun Electronics SKU : COM-00527
IC11 = My library:ISO1541D
IC12 IC13 = My library:74*4053: Triple 2-channel analog multiplexer/demultiplexer Philips Semiconductor
IC15 = My library:MCP3428
IC16 = My library:MCP23008: MCP23008 Inexpensive i2c i/o expander - 8 general purpose i/o pins with optional pullups
IC17 = adafruit:78*: Positive VOLTAGE REGULATOR Added bigger pads to the TO-92 package
IC18 = burr-brown:REG1117: 800mA and 1A Low Dropout (LDO) Positive Regulator 1.8V, 2.5V, 2.85V, 3.3V, 5V, and Adj; MPN: REG1117; OC_FARNELL: 1097566; OC_NEWARK: 14P6981
J2 = My library:POWER_JACK: Power Jack Connector This is the standard 5.5mm barrel jack for power. The PTH is the most common, proven, reliable, footprint. The Slot footprint only works if the mill layer is transmitted to the PCB fab house so be warned. Here are the connectors we sell at SparkFun: DC Barrel Power Jack/Connector <https://www.sparkfun.com/products/119> (PRT-00119) DC Barrel Power Jack/Connector (SMD) <https://www.sparkfun.com/products/12748> (PRT-12748) DC Barrel Jack Adapter - Breadboard Compatible <https://www.sparkfun.com/products/10811> (PRT-10811) It is used on this SparkFun product (and many, many others): SparkFun RedBoard - Programmed with Arduino <https://www.sparkfun.com/products/12757> (DEV-12757) Also, if you need a mating power supply or connector, please check these out: Wall Adapter Power Supply - 9VDC 650mA <https://www.sparkfun.com/products/298> (TOL-00298) DC Barrel Jack Adapter - Male <https://www.sparkfun.com/products/10287> (PRT-10287); PROD_ID: CONN-08197
J3 = OPL_Connector:MICRO-SD-CARD-HOLDER-9P: 320090008
JP1 JP8 = pinhead:PINHD-1X2: PIN HEADER
JP2 = pinhead:PINHD-2X22: PIN HEADER
JP3 = pinhead:PINHD-2X17: PIN HEADER
JP4 = pinhead:PINHD-2X2: PIN HEADER
JP5-JP7 = pinhead:PINHD-2X5: PIN HEADER
K15 RST WK_UP = My library:SWITCH-SWITCH-SMD-3.0X4.0X2.0MM
Q1 = transistor-power:TIP2955: PNP TRANSISTOR
Q2 = BeagleBone_Blue_R3:MOSFET-NCHANNEL: Common NMOSFET Parts MFG P/N Store ID Prod ID FDD8780 TRANS-09984 SI7820DN TRANS-11055 FDS6630A IC-08089 2N7002PW TRANS-11151 FQP30N06L COM-10213 TRANS-10060 BSS123LT1G TRANS-08345 BSS138 TRANS-00830 BS170 2N7000; PROD_ID: TRANS-00830
Q3 = OPL_Discrete_Semiconductor:SMD-MOSFET-P-CH-20V-2A-FDN340P(SOT-23): 305030026; MPN: FDN340P
Q4 = transistor-power:TIP42C: PNP TRANSISTOR
R1-R11 R13-R75 R78-R86 = rcl:R-US_: RESISTOR, American symbol; SPICEPREFIX: R
R12 R76 R77 = rcl:R-EU_: RESISTOR, European symbol; SPICEPREFIX: R
SJ1-SJ4 = SparkFun-Retired:SOLDERJUMPER_2WAY-OLD: Solder Jumper 2 way solder jumper
SJ5 = jumper:SJ: SMD solder JUMPER
SV1 SV3 = pinhead:PINHD-1X4: PIN HEADER
T1 = transistor:*-PNP-: PNP Transistror
T2 = transistor:BC847: NPN TRANSISTOR
T3 T4 = DC_LOAD_AU:*-NPN-: NPN Transistror BF959 corrected 2008.03.06
U1 = SparkFun-IC-Memory:SPI_FLASH-X25XX: 32M Serial Flash Memory 8pin SPI Flash series x25xx. Works with devices like W25X32 and BR25L32 Datasheet <http://www.macronix.com/Lists/Datasheet/Attachments/5031/MX25L3206E,%203V,%2032Mb,%20v1.5.pdf> SparkFun Products SparkFun Venus GPS Logger <https://www.sparkfun.com/products/10920> (GPS-10920); PROD_ID: N/A; VALUE: 32M SPI Flash
U$4 U$27 = My library:EL357
U$20 = My library:MCP9700
U$22 U$24 = My library:L79L05
U$28 = My library:STM32F427VIT6: STM32F405RGT6 ARM DSP Chip used on the WAV Trigger board. IC MCU 32BIT 1MB FLASH 64LQFP Datasheet <https://cdn.sparkfun.com/datasheets/Widgets/STM32F405RGT6.pdf> SparkFun Products WAV Trigger <https://www.sparkfun.com/products/13660> (WIG-13660)
U$29 = My library:CS4344
USB = adafruit:USB: USB Connectors USBMINIB - Surface Mount Female Mini-B USB Connector 4UConnector: 06564 By microbuilder.eu Thru-hole RA Female Mini-B USB Connector 4UConnector: 18732 By ladyada.net
X1 = con-phoenix-254:MPT4: PHOENIX CONNECTOR; OC_FARNELL: unknown; OC_NEWARK: unknown
X3 = con-phoenix-254:MPT2: PHOENIX CONNECTOR; OC_FARNELL: unknown; OC_NEWARK: unknown
Y2 = SparkFun-Clocks:CRYSTAL: Crystals (Generic) These are passive quartz crystals, which can be used as a clock source for a microcontroller. Crystal's are two-terminal devices. They require external "load" capacitors to generate an oscillating signal.
Y3 = SparkFun-Clocks:CRYSTAL-32.768KHZ: 32.768kHz Crystal Frequency: 32.768kHz Frequency Stability: ±20ppm Load Capacitance: 12.5pF (PTH-2X6 & SMD-3.2X1.5), 6pF (SMD-2X6) SparkFun Products: SparkFun BigTime Watch Kit <https://www.sparkfun.com/products/11734> SparkFun nRF52832 Breakout <https://www.sparkfun.com/products/13990> SparkFun Real Time Clock Module <https://www.sparkfun.com/products/12708>; PROD_ID: XTAL-10112

## Net classes
0 default: clearance 0.205 mm